# Altium schematic sheet top.SchDoc: Multiplekser interfejsu SWD
size A4; Module: Top; Organization: Altium Limited; Address1: L3, 12a Rodborough Rd; Adress2: Frenchs Forest; Address3: NSW; Address4: Australia 2086; SheetNumber: 1
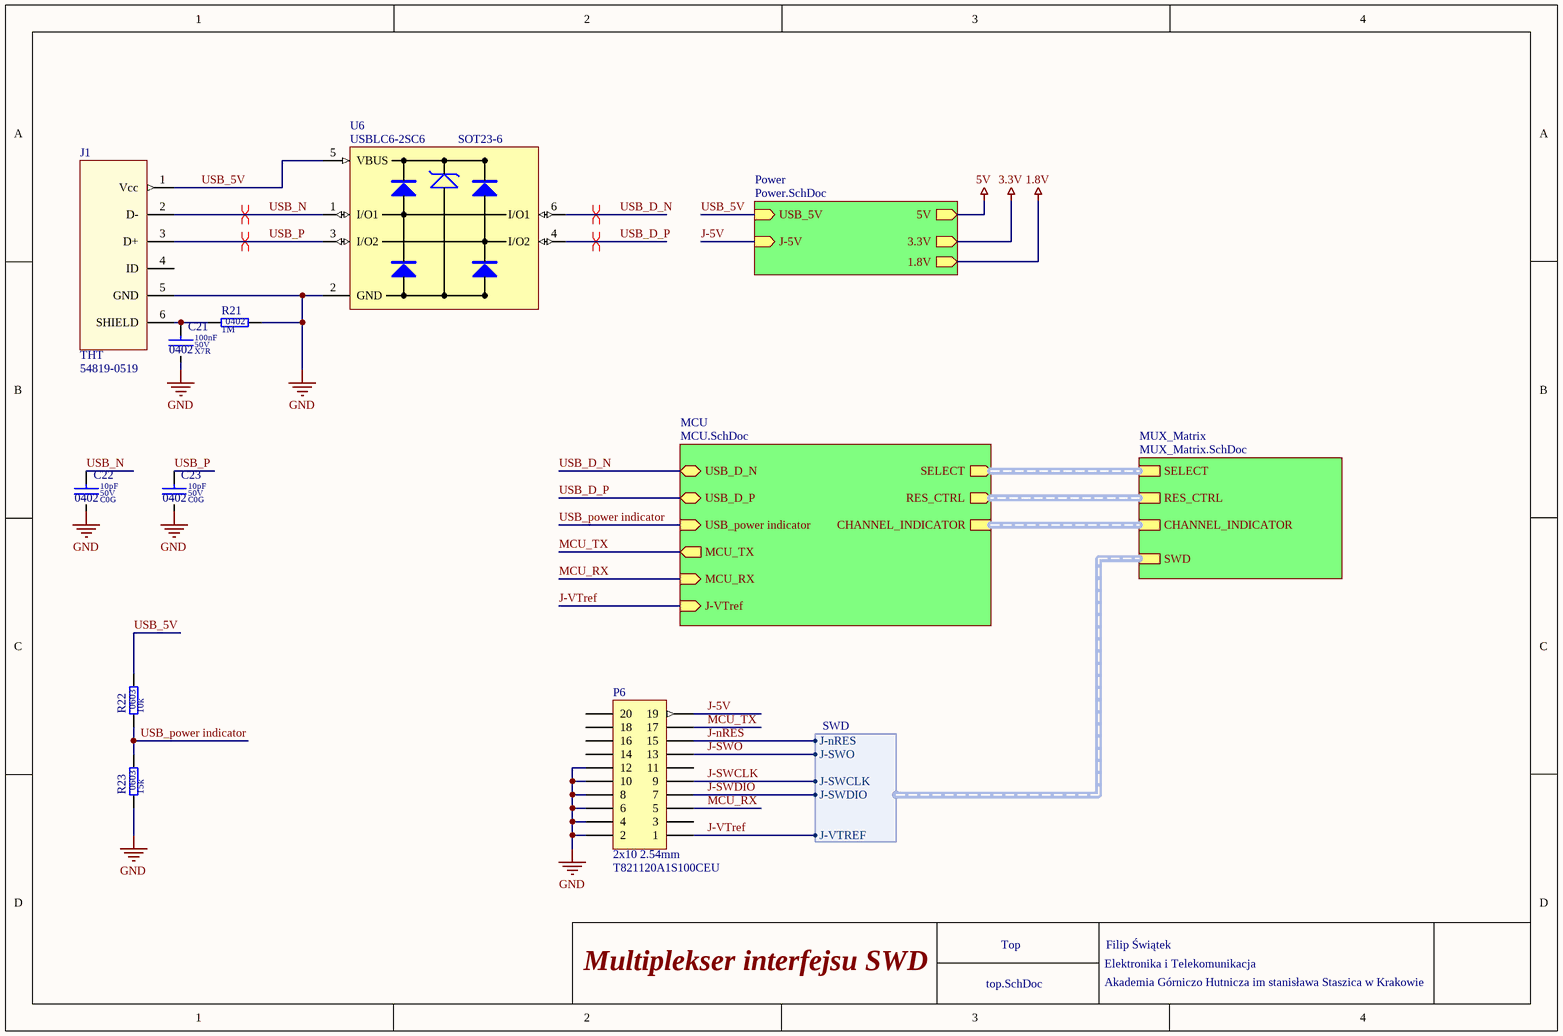
[diagram p0: top.SchDoc]

## Parts
C21  value 100nF  Dielectric: X7R  Voltage: 50V  SCH_Footprint: 0402  [C_0402_1005]  (hidden comment: Ceramic X7R)
C22  value 10pF  Dielectric: C0G  Voltage: 50V  SCH_Footprint: 0402  [C_0402_1005]  (hidden comment: Ceramic C0G)
C23  value 10pF  Dielectric: C0G  Voltage: 50V  SCH_Footprint: 0402  [C_0402_1005]  (hidden comment: Ceramic C0G)
J1  value 54819-0519  SCH_Footprint: THT  [J_USB_MINIB_54819-0519_THT]  (hidden comment: USB connector)
P6  value T821120A1S100CEU  SCH_Footprint: 2x10 2.54mm  [P_IDC_2x10_2.54]  (hidden comment: 2x10 IDC 2.54mm shrouded)
R21  value 1M  SCH_Footprint: 0402  [R_0402_1005]  (hidden comment: Resistor)
R22  value 10k  SCH_Footprint: 0603  [R_0603_1608]  (hidden comment: Resistor)
R23  value 15k  SCH_Footprint: 0603  [R_0603_1608]  (hidden comment: Resistor)
U6  value USBLC6-2SC6  SCH_Footprint: SOT23-6  [SOT23-6_SC74A_SOT753]  (hidden comment: USB 2.0/1.1, Ethernet and SIM card ESD protection)

## Sub-sheets
MCU = MCU.SchDoc: USB_D_N (bidir), USB_D_P (bidir), USB_power indicator (in), SELECT (out, harness SELECT), MCU_TX (out), MCU_RX (in), J-VTref (in), RES_CTRL (out, harness RES_CTRL), CHANNEL_INDICATOR (harness CHANNEL_INDICATOR)
MUX_Matrix = MUX_Matrix.SchDoc: SWD (harness SWD), SELECT (harness SELECT), RES_CTRL (harness RES_CTRL), CHANNEL_INDICATOR (harness CHANNEL_INDICATOR)
Power = Power.SchDoc: J-5V (in), USB_5V (in), 5V (out), 3.3V (out), 1.8V (out)

## Harnesses
SWD: J-nRES, J-SWO, J-SWCLK, J-SWDIO, J-VTREF

## Nets
1.8V: sheet Power/1.8V
3.3V: sheet Power/3.3V
5V: sheet Power/5V
GND: C21.2 C22.2 C23.2 J1.5(GND) P6.2 P6.4 P6.6 P6.8 P6.10 P6.12 R21.2 R23.1 U6.2(GND)
J-5V: P6.19 ; sheet Power/J-5V
J-nRES: P6.15 ; sheet MUX_Matrix/SWD.J-nRES
J-SWCLK: P6.9 ; sheet MUX_Matrix/SWD.J-SWCLK
J-SWDIO: P6.7 ; sheet MUX_Matrix/SWD.J-SWDIO
J-SWO: P6.13 ; sheet MUX_Matrix/SWD.J-SWO
J-VTref: P6.1 ; sheet MCU/J-VTref, sheet MUX_Matrix/SWD.J-VTREF
MCU_RX: P6.5 ; sheet MCU/MCU_RX
MCU_TX: P6.17 ; sheet MCU/MCU_TX
USB_5V: J1.1(Vcc) R22.2 U6.5(VBUS) ; sheet Power/USB_5V
USB_D_N: U6.6(I/O1) ; sheet MCU/USB_D_N
USB_D_P: U6.4(I/O2) ; sheet MCU/USB_D_P
USB_N: C22.1 J1.2(D-) U6.1(I/O1)
USB_P: C23.1 J1.3(D+) U6.3(I/O2)
USB_power indicator: R22.1 R23.2 ; sheet MCU/USB_power indicator
NetC21_1: C21.1 J1.6(SHIELD) R21.1

Not connected (* = marked no-connect by the designer): J1 4(ID); P6 3 11 14 16 18 20

## Buses and harness runs
harness sheet MCU/CHANNEL_INDICATOR = sheet MUX_Matrix/CHANNEL_INDICATOR
harness sheet MCU/RES_CTRL = sheet MUX_Matrix/RES_CTRL
harness sheet MCU/SELECT = sheet MUX_Matrix/SELECT

## Layout directives
differential pair: USB_D_N, USB_D_P, USB_N, USB_P

## Notes on the sheet
- Elektronika i Telekomunikacja
- Akademia Górniczo Hutnicza im stanisława Staszica w Krakowie
- Filip Świątek

## Library data of the parts
C21 = C_100nF_50V_X7R_0402_10: Capacitor; Manufacturer: Murata; Manufacturer Part Number: GRM155R71H104KE14D; Tolerance (%): 10; Part Number: C_100nF_50V_X7R_0402_10; HelpURL: http://docs-europe.electrocomponents.com/webdocs/145f/0900766b8145f9d2.pdf; Supplier 1: TME; Supplier Part Number 1: GRM155R71H104KE14D; Supplier 2: RS Components; Supplier Part Number 2: 8847087; Supplier 3: Farnell; Supplier Part Number 3: 2611912; Supplier 4: Mouser; Supplier Part Number 4: 81-GRM155R71H104KE4D; Supplier 5: Digi-Key; Supplier Part Number 5: 490-10700-1-ND
C22 C23 = C_10pF_50V_C0G_0402_5: Capacitor; Manufacturer: Murata; Manufacturer Part Number: GRM1555C1H100JA01D; Tolerance (%): 5; Part Number: C_10pF_50V_C0G_0402_5; HelpURL: https://www.mouser.com/ds/2/281/c02e-2905.pdf; Supplier 1: TME; Supplier 2: RS Components; Supplier 3: Farnell; Supplier 4: Mouser; Supplier Part Number 4: 81-GRM1555C1H100JA1D; Supplier 5: Digi-Key
J1 = J_USB_MINIB_54819-0519: Złącze USB, Mini USB typu B, USB 2.0 OTG, Montaż przewlekany; Manufacturer: Molex; Part Number: J_USB_MINIB_54819-0519; Component Type: Standard; HelpURL: http://www.molex.com/pdm_docs/sd/548190519_sd.pdf; Manufacturer Part Number: 54819-0519; Supplier 1: TME; Supplier Part Number 1: MX-54819-0519; Supplier 2: RS Components; Supplier Part Number 2: 5152005P; Supplier 3: Farnell; Supplier Part Number 3: 9786465; Supplier 4: Mouser; Supplier Part Number 4: 538-54819-0519; Supplier 5: Digi-Key
P6 = P_IDC_2x10_2.54: Header, 20-Pin; Manufacturer: Amphenol; Part Number: P_IDC_2x10_2.54; Component Type: Standard; HelpURL: https://datasheet.octopart.com/T821120A1S100CEU-Amphenol-datasheet-12110023.pdf; Manufacturer Part Number: T821120A1S100CEU; Supplier 1: TME; Supplier Part Number 1: T821-1-20-S1; Supplier 2: RS Components; Supplier Part Number 2: 832-3499; Supplier 3: Farnell; Supplier Part Number 3: 2215309; Supplier 4: Mouser; Supplier 5: Digi-Key
R21 = R_1M_0402_1: Manufacturer: Vishay; Manufacturer Part Number: CRCW04021M00FKED; Voltage: 50V; Power: 200mW; Tolerance: 1%; Part Number: R_1M_0402_1; HelpURL: http://datasheet.octopart.com/CRCW04021M00FKED.-Vishay-datasheet-78776209.pdf; Supplier 1: TME; Supplier 2: RS Components; Supplier Part Number 2: 6788923; Supplier 3: Farnell; Supplier Part Number 3: 1469667; Supplier 4: Mouser; Supplier Part Number 4: 71-CRCW0402-1.0M-E3; Supplier 5: Digi-Key; Supplier Part Number 5: 541-1.00MLCT-ND
R22 = R_10k_0603_1: Manufacturer: Vishay; Manufacturer Part Number: CRCW060310K0FKTABC; Voltage: 75V; Power: 100mW; Tolerance: 1%; Part Number: R_10k_0603_1; HelpURL: http://www.tme.eu/pl/Document/622e28308c06d160637f2b14751ba16b/Data%20Sheet%20CRCW_BCe3.pdf; Supplier 1: TME; Supplier Part Number 1: CRCW060310K0FKTABC; Supplier 2: RS Components; Supplier 3: Farnell; Supplier 4: Mouser; Supplier Part Number 4: 667-ERJ-3EKF1002V; Supplier 5: Digi-Key; Supplier Part Number 5: P10KGCT-ND
R23 = R_15k_0603_1: Manufacturer: Yageo; Manufacturer Part Number: RC0603FR-0715KL; Voltage: 50V; Power: 100mW; Tolerance: 1%; Part Number: R_15k_0603_1; HelpURL: http://www.tme.eu/pl/Document/d2a72e545e5c8eb7bf2a04fa97535928/rc0603yageo.pdf; Supplier 1: TME; Supplier Part Number 1: RC0603FR-0715K; Supplier 2: RS Components; Supplier 3: Farnell; Supplier Part Number 3: 2413677; Supplier 4: Mouser; Supplier Part Number 4: 603-RC0603FR-0715KL; Supplier 5: Digi-Key; Supplier Part Number 5: 311-15.0KHRCT-ND
U6 = U_USBLC6-2SC6: Manufacturer: STMicroelectronics; Part Number: U_USBLC6-2SC6; HelpURL: https://www.st.com/resource/en/datasheet/usblc6-2.pdf; Manufacturer Part Number: USBLC6-2SC6; Supplier 1: TME; Supplier Part Number 1: USBLC6-2SC6; Supplier 2: RS Components; Supplier Part Number 2: 624-7693; Supplier 3: Farnell; Supplier Part Number 3: 2473979; Supplier 4: Mouser; Supplier Part Number 4: 511-USBLC6-2SC6; Supplier 5: Digi-Key; Supplier Part Number 5: 497-5235-1-ND